# Altium schematic sheet Grid_Lock.SchDoc
size A4
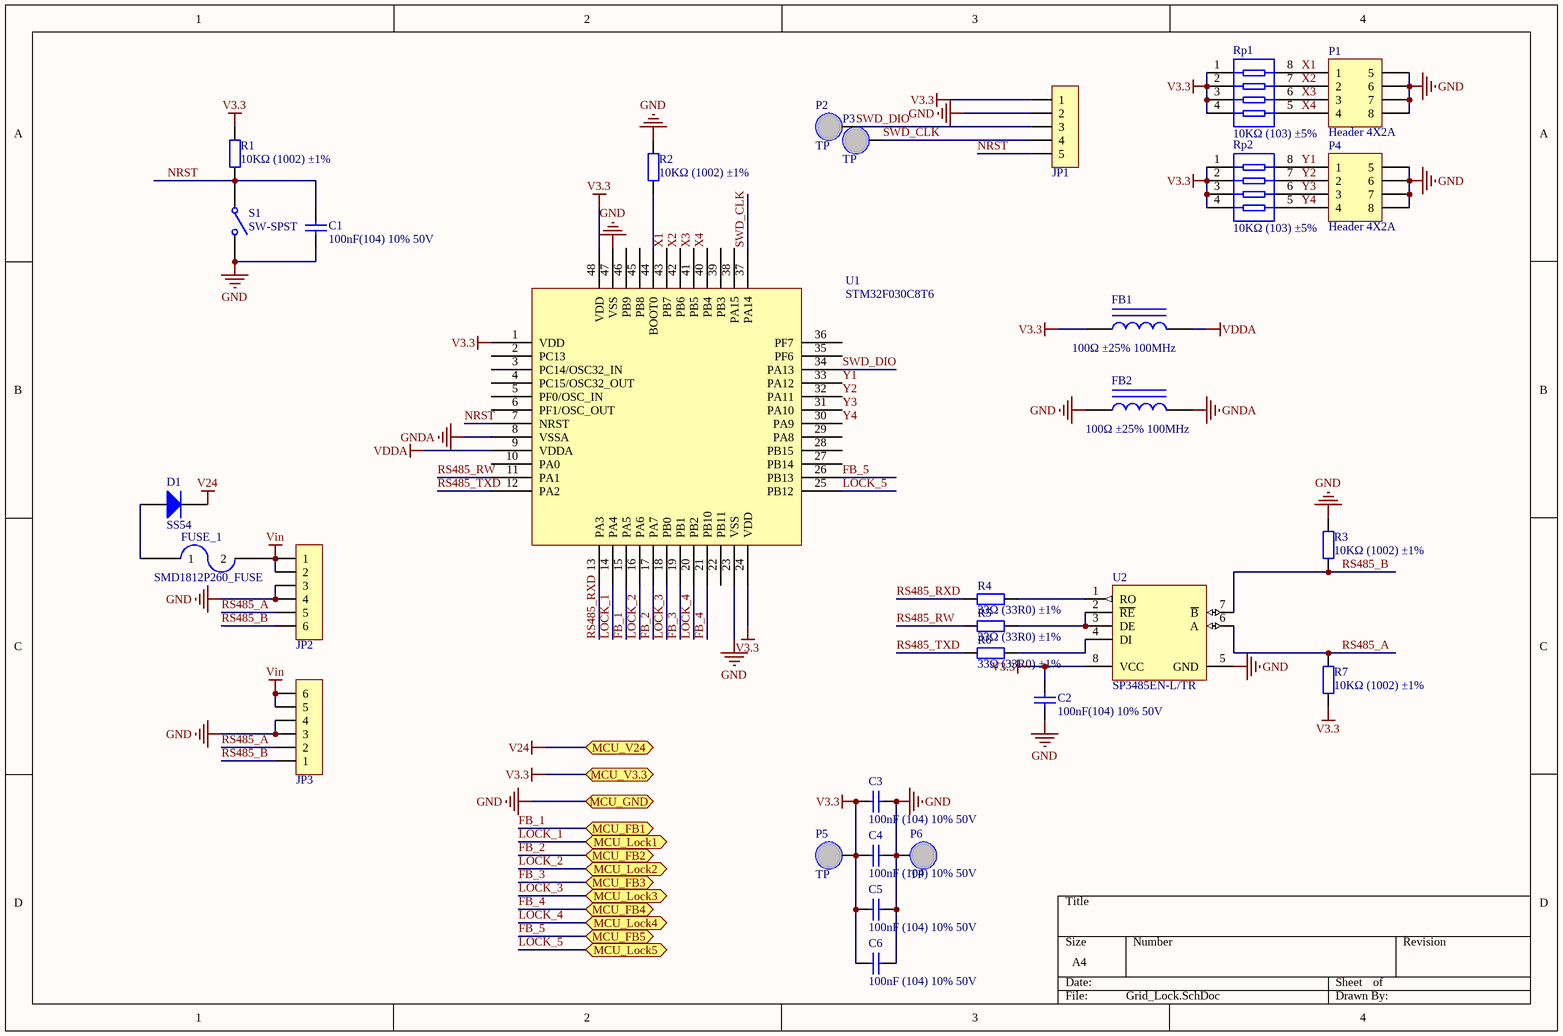
[diagram p0: Grid_Lock.SchDoc]

## Parts
C1  100nF(104) 10% 50V  [0805_C]
C2  100nF(104) 10% 50V  [0805_C]
C3  100nF (104) 10% 50V  [0603_C]
C4  100nF (104) 10% 50V  [0603_C]
C5  100nF (104) 10% 50V  [0603_C]
C6  100nF (104) 10% 50V  [0603_C]
D1  SS54  [SMA(DO-214AC)_S1]
FB1  100Ω ±25% 100MHz  [0805_L]
FB2  100Ω ±25% 100MHz  [0805_L]
FUSE_1  SMD1812P260_FUSE  [SMD1812P260]
JP1  HDR-1X5  [XH2.54-WS-5P]  (value not drawn)
JP2  HDR-1X6  [XH2.54-WS-6P]  (value not drawn)
JP3  HDR-1X6  [XH2.54-WS-6P]  (value not drawn)
P1  Header 4X2A  [HDR2X4_CEN]
P2  TP
P3  TP
P4  Header 4X2A  [HDR2X4_CEN]
P5  TP
P6  TP
R1  10KΩ (1002) ±1%  [0805_R]
R2  10KΩ (1002) ±1%  [0805_R]
R3  10KΩ (1002) ±1%  [0805_R]
R4  33Ω (33R0) ±1%  [0603_R]
R5  33Ω (33R0) ±1%  [0603_R]
R6  33Ω (33R0) ±1%  [0603_R]
R7  10KΩ (1002) ±1%  [0805_R]
Rp1  10KΩ (103) ±5%  [0603_Rx4]
Rp2  10KΩ (103) ±5%  [0603_Rx4]
S1  SW-SPST  [key]
U1  STM32F030C8T6  [LQFP-48_7x7x05P]
U2  SP3485EN-L/TR  [SOIC-8_150mil]

## Ports
MCU_FB1, MCU_FB2, MCU_FB3, MCU_FB4, MCU_FB5, MCU_GND, MCU_Lock1, MCU_Lock2, MCU_Lock3, MCU_Lock4, MCU_Lock5, MCU_V3.3, MCU_V24

## Nets
GND: C1.1 C2.1 C3.2 C4.2 C5.2 C6.2 FB2.1 JP1.2 JP2.3 JP2.4 JP3.3 JP3.4 P1.5 P1.6 P1.7 P1.8 P4.5 P4.6 P4.7 P4.8 P6.1 R2.2 R3.2 S1.2(NO) U1.23(VSS) U1.47(VSS) U2.5(GND) ; port MCU_GND
GNDA: FB2.2 U1.8(VSSA)
V3.3: C2.2 C3.1 C4.1 C5.1 C6.1 FB1.1 JP1.1 P5.1 R1.2 R7.1 Rp1.1 Rp1.2 Rp1.3 Rp1.4 Rp2.1 Rp2.2 Rp2.3 Rp2.4 U1.1(VDD) U1.24(VDD) U1.48(VDD) U2.8(VCC) ; port MCU_V3.3
V24: D1.2(K) ; port MCU_V24
VDDA: FB1.2 U1.9(VDDA)
Vin: FUSE_1.2 JP2.1 JP2.2 JP3.5 JP3.6
FB_1: U1.15(PA5) ; port MCU_FB1
FB_2: U1.17(PA7) ; port MCU_FB2
FB_3: U1.19(PB1) ; port MCU_FB3
FB_4: U1.21(PB10) ; port MCU_FB4
FB_5: U1.26(PB13) ; port MCU_FB5
LOCK_1: U1.14(PA4) ; port MCU_Lock1
LOCK_2: U1.16(PA6) ; port MCU_Lock2
LOCK_3: U1.18(PB0) ; port MCU_Lock3
LOCK_4: U1.20(PB2) ; port MCU_Lock4
LOCK_5: U1.25(PB12) ; port MCU_Lock5
NRST: C1.2 JP1.5 R1.1 S1.1(COMMON) U1.7(NRST)
RS485_A: JP2.5 JP3.2 R7.2 U2.6(A)
RS485_B: JP2.6 JP3.1 R3.1 U2.7(~{B})
RS485_RW: R5.1 U1.11(PA1)
RS485_RXD: R4.1 U1.13(PA3)
RS485_TXD: R6.1 U1.12(PA2)
SWD_CLK: JP1.4 P3.1 U1.37(PA14)
SWD_DIO: JP1.3 P2.1 U1.34(PA13)
X1: P1.1 Rp1.8 U1.43(PB7)
X2: P1.2 Rp1.7 U1.42(PB6)
X3: P1.3 Rp1.6 U1.41(PB5)
X4: P1.4 Rp1.5 U1.40(PB4)
Y1: P4.1 Rp2.8 U1.33(PA12)
Y2: P4.2 Rp2.7 U1.32(PA11)
Y3: P4.3 Rp2.6 U1.31(PA10)
Y4: P4.4 Rp2.5 U1.30(PA9)
NetD1_1: D1.1(A) FUSE_1.1
NetR2_1: R2.1 U1.44(BOOT0)
NetR4_2: R4.2 U2.1(RO)
NetR5_2: R5.2 U2.2(~{RE}) U2.3(DE)
NetR6_2: R6.2 U2.4(DI)

Not connected (* = marked no-connect by the designer): U1 2(PC13) 3(PC14/OSC32_IN) 4(PC15/OSC32_OUT) 5(PF0/OSC_IN) 6(PF1/OSC_OUT) 10(PA0) 22(PB11) 27(PB14) 28(PB15) 29(PA8) 35(PF6) 36(PF7) 38(PA15) 39(PB3) 45(PB8) 46(PB9)

## Library data of the parts
C1 C2 = 0805 100nF(104) 10% 50V: 贴片电容; ComponentLink1Description: 供应商链接; ComponentLink1URL: http://www.szlcsc.com/product/details_50686.html; Package: 0805; Supplier: LC; SuppliersPartNumber: C49678
C3-C6 = 0603 100nF (104) 10% 50V: 贴片电容; ComponentLink1Description: 供应商链接; ComponentLink1URL: http://www.szlcsc.com/product/details_15331.html; Package: 0603; Supplier: LC; SuppliersPartNumber: C14663
D1 = SMA(DO-214AC) SS54: 二极管; ComponentLink1Description: 供应商链接; ComponentLink1URL: http://www.szlcsc.com/product/details_23178.html; Package: SMA(DO-214AC); Supplier: LC; SuppliersPartNumber: C22452
FB1 FB2 = 0805 100Ω 25% 100MHz: 贴片磁珠; ComponentLink1Description: 供应商链接; ComponentLink1URL: http://www.szlcsc.com/product/details_1367.html; Package: 0805; Supplier: LC; SuppliersPartNumber: C1015
JP1 = Header 5: 5P接插件; 版权归属: 源创客; BOM名称: 5P接插件; 学习资源: www.ooocke.com
JP2 JP3 = Header 6: 6P接插件; 版权归属: 源创客; BOM名称: 6P接插件; 学习资源: www.ooocke.com
P1 P4 = Header 4X2A: Header, 4-Pin, Dual row; LatestRevisionDate: 17-Jul-2002; LatestRevisionNote: Re-released for DXP Platform.; Publisher: Altium Limited
R1-R3 R7 = 0805 10KΩ (1002) 1%: 贴片电阻; ComponentLink1Description: 供应商链接; ComponentLink1URL: http://www.szlcsc.com/product/details_18102.html; Package: 0805; Supplier: LC; SuppliersPartNumber: C17414
R4-R6 = 0603 33Ω (33R0) 1%: 贴片电阻; ComponentLink1Description: 供应商链接; ComponentLink1URL: http://www.szlcsc.com/product/details_23867.html; Package: 0603; Supplier: LC; SuppliersPartNumber: C23140
Rp1 Rp2 = 0603*4  10KΩ (103) 5%: 贴片排阻; ComponentLink1Description: 供应商链接; ComponentLink1URL: http://www.szlcsc.com/product/details_30472.html; Package: 0603*4; Supplier: LC; SuppliersPartNumber: C29718
S1 = SW-SPST: Single-Pole, Single-Throw Switch; Published: 24-Mar-1999; LatestRevisionDate: 17-Jul-2002; LatestRevisionNote: Re-released for DXP Platform.; PackageReference: SPST-2; Publisher: Altium Limited; PackageDescription: Switch; 2 Leads
U1 = STM32F030C8T6: ARM; ComponentLink1Description: 供应商链接; ComponentLink1URL: http://www.szlcsc.com/product/details_24662.html; Package: LQFP-48_7x7x05P; Supplier: LC; SuppliersPartNumber: C23922
U2 = SP3485EN-L/TR_[C8963]: RS-485/RS-422; ComponentLink1Description: 供应商链接; ComponentLink1URL: http://www.szlcsc.com/product/details_9482.html; Package: SOIC-8; Supplier: LC; SuppliersPartNumber: C8963